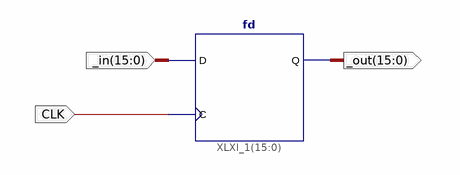
[diagram p0: schematic sheet 1]
// Xilinx ISE schematic buffer_16bit.sch (spartan6) as structural Verilog: 1 symbols, 3 ports
module buffer_16bit (
  input  [15:0] _in,
  input  CLK,
  output [15:0] _out
);

  fd XLXI_1[15:0] (.C(CLK), .D(_in), .Q(_out));
endmodule
